# EAGLE design trainer (EAGLE 7.4.0)
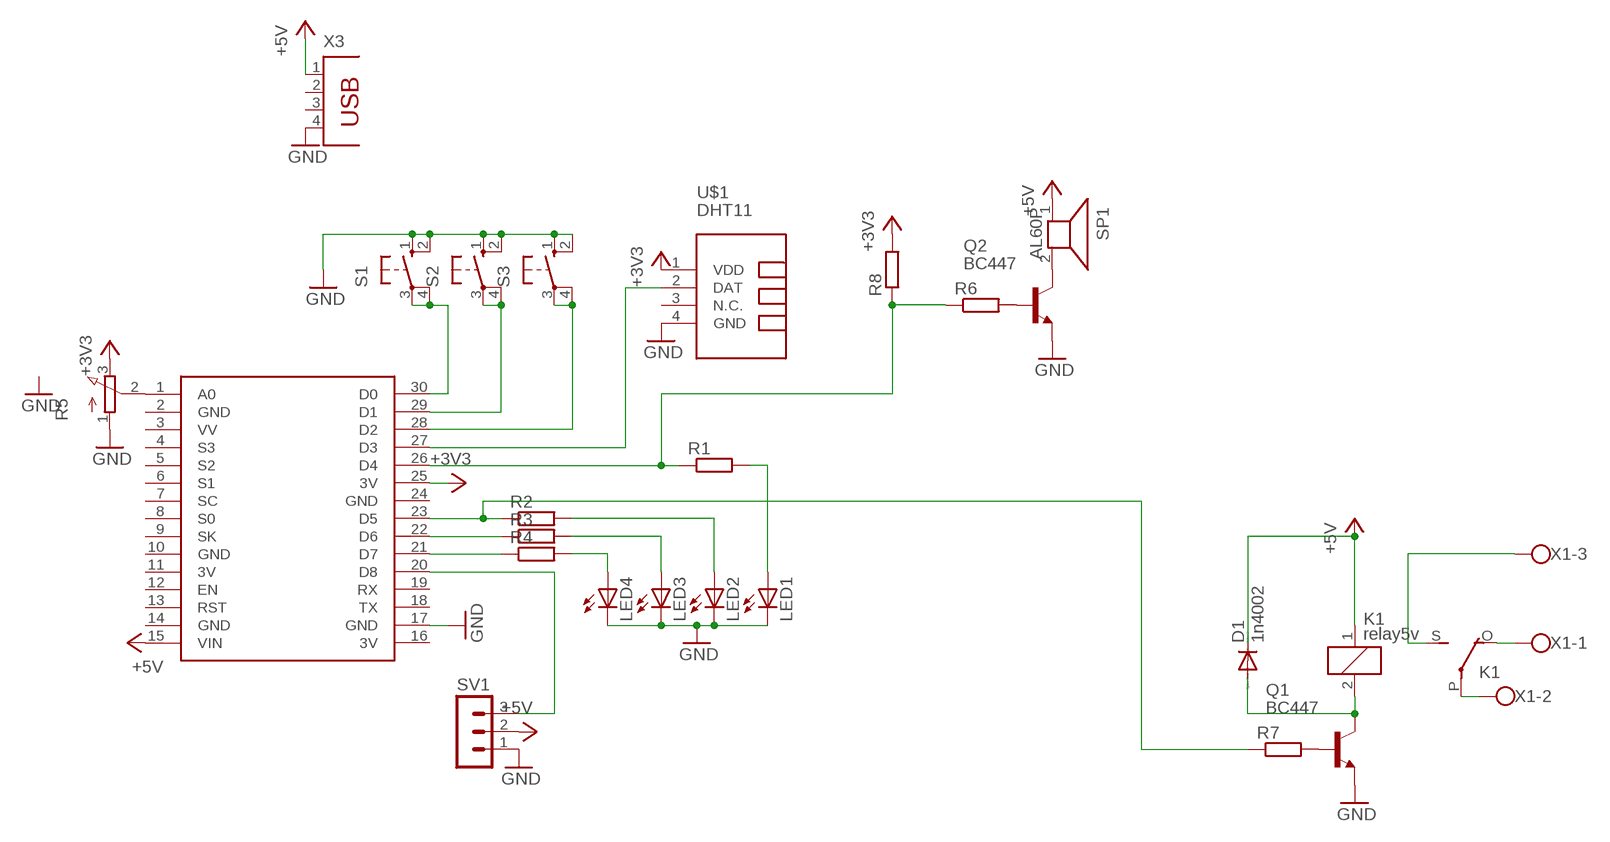
[diagram p0: schematic, sheet 1]

## Parts
D1  1n4002  1N4446  [DO35-10]
K1  relay5v  ZF112  [ZF112]
LED1  LED5MM  [LED5MM]
LED2  LED5MM  [LED5MM]
LED3  LED5MM  [LED5MM]
LED4  LED5MM  [LED5MM]
Q1  BC447  [TO92-EBC]
Q2  BC447  [TO92-EBC]
R1  R-EU_0207/10  [0207/10]
R2  R-EU_0207/10  [0207/10]
R3  R-EU_0207/10  [0207/10]
R4  R-EU_0207/10  [0207/10]
R5  3RP/1610N  [3RP/1610N]
R6  R-EU_0207/10  [0207/10]
R7  R-EU_0207/10  [0207/10]
R8  R-EU_0207/10  [0207/10]
S1  10-XX  [B3F-10XX]
S2  10-XX  [B3F-10XX]
S3  10-XX  [B3F-10XX]
SP1  AL60P  [AL60P]
SV1  MA03-1  [MA03-1]
U$1  DHT11  TEMP-HUM-SENSOR-DHT11  [TEMP-HUM-SENSOR-DHT11]
U$2  NODEMCU  [NODEMCU]
X1  W237-103  [W237-103]
X3  PN61729  [PN61729]

## Nets
+3V3: R5.3(E) R8.2 U$1.1(VDD) U$2.25(3V)
+5V: D1.C K1.1 SP1.1 SV1.2 U$2.15(VIN) X3.1
GND: LED1.K(C) LED2.K(C) LED3.K(C) LED4.K(C) Q1.E Q2.E R5.1(A) S1.1(S) S1.2(S1) S2.1(S) S2.2(S1) S3.1(S) S3.2(S1) SV1.1 U$1.4(GND) U$2.17(GND) X3.4
N$1: R1.1 R6.1 R8.1 U$2.26(D4)
N$2: R2.1 R7.1 U$2.23(D5)
N$3: R3.1 U$2.22(D6)
N$4: R4.1 U$2.21(D7)
N$5: LED1.A R1.2
N$6: LED2.A R2.2
N$7: LED3.A R3.2
N$8: LED4.A R4.2
N$9: SV1.3 U$2.20(D8)
N$10: R5.2(S) U$2.1(A0)
N$11: Q2.C SP1.2
N$12: Q2.B R6.2
N$13: K1.S(2:S) X1.3
N$14: D1.A K1.2 Q1.C
N$15: Q1.B R7.2
N$16: U$1.2(DAT) U$2.27(D3)
N$17: S1.3(P) S1.4(P1) U$2.30(D0)
N$18: S2.3(P) S2.4(P1) U$2.29(D1)
N$19: S3.3(P) S3.4(P1) U$2.28(D2)
N$20: K1.P(2:P) X1.2
N$21: K1.O(2:O) X1.1
Unconnected: U$1.3(N.C.) U$2.3(VV) U$2.4(S3) U$2.5(S2) U$2.6(S1) U$2.7(SC) U$2.8(S0) U$2.9(SK) U$2.12(EN) U$2.13(RST) U$2.18(TX) U$2.19(RX) X3.2 X3.3

## Power pins joined to a net without a drawn wire
3V: U$2.11(3V) U$2.16(3V)
GND: U$2.2(GND) U$2.10(GND) U$2.14(GND) U$2.24(GND)

## Library data of the parts
D1 = diode:1N4446: DIODE high speed (Philips)
K1 = relay:ZF112: RELAY 1 x switch; OC_FARNELL: unknown; OC_NEWARK: unknown
LED1-LED4 = led:LED: LED OSRAM: - CHIPLED LG R971, LG N971, LY N971, LG Q971, LY Q971, LO R971, LY R971 LH N974, LH R974 LS Q976, LO Q976, LY Q976 LO Q996 - Hyper CHIPLED LW Q18S LB Q993, LB Q99A, LB R99A - SideLED LS A670, LO A670, LY A670, LG A670, LP A670 LB A673, LV A673, LT A673, LW A673 LH A674 LY A675 LS A676, LA A676, LO A676, LY A676, LW A676 LS A679, LY A679, LG A679 - Hyper Micro SIDELED® LS Y876, LA Y876, LO Y876, LY Y876 LT Y87S - SmartLED LW L88C, LW L88S LB L89C, LB L89S, LG L890 LS L89K, LO L89K, LY L89K LS L896, LA L896, LO L896, LY L896 - TOPLED LS T670, LO T670, LY T670, LG T670, LP T670 LSG T670, LSP T670, LSY T670, LOP T670, LYG T670 LG T671, LOG T671, LSG T671 LB T673, LV T673, LT T673, LW T673 LH T674 LS T676, LA T676, LO T676, LY T676, LB T676, LH T676, LSB T676, LW T676 LB T67C, LV T67C, LT T67C, LS T67K, LO T67K, LY T67K, LW E67C LS E67B, LA E67B, LO E67B, LY E67B, LB E67C, LV E67C, LT E67C LW T67C LS T679, LY T679, LG T679 LS T770, LO T770, LY T770, LG T770, LP T770 LB T773, LV T773, LT T773, LW T773 LH T774 LS E675, LA E675, LY E675, LS T675 LS T776, LA T776, LO T776, LY T776, LB T776 LHGB T686 LT T68C, LB T68C - Hyper Mini TOPLED® LB M676 - Mini TOPLED Santana® LG M470 LS M47K, LO M47K, LY M47K Source: http://www.osram.convergy.de LUXEON: - LUMILED® LXK2-PW12-R00, LXK2-PW12-S00, LXK2-PW14-U00, LXK2-PW14-V00 LXK2-PM12-R00, LXK2-PM12-S00, LXK2-PM14-U00 LXK2-PE12-Q00, LXK2-PE12-R00, LXK2-PE12-S00, LXK2-PE14-T00, LXK2-PE14-U00 LXK2-PB12-K00, LXK2-PB12-L00, LXK2-PB12-M00, LXK2-PB14-N00, LXK2-PB14-P00, LXK2-PB14-Q00 LXK2-PR12-L00, LXK2-PR12-M00, LXK2-PR14-Q00, LXK2-PR14-R00 LXK2-PD12-Q00, LXK2-PD12-R00, LXK2-PD12-S00 LXK2-PH12-R00, LXK2-PH12-S00 LXK2-PL12-P00, LXK2-PL12-Q00, LXK2-PL12-R00 Source: www.luxeon.com KINGBRIGHT: KA-3528ASYC Source: www.kingbright.com
Q1 Q2 = transistor-npn:BC447*: NPN Transistor
R1-R4 R6-R8 = rcl:R-EU_: RESISTOR, European symbol
R5 = pot:3RP/1610N: 16mm Potentiometer one level Source: http://www.alphapotentiometers.net/html/16mm_pot_2.html
S1-S3 = switch-omron:10-XX: OMRON SWITCH; MPN: B3F-1000; OC_FARNELL: 176432; OC_NEWARK: 36M3542
SP1 = buzzer:AL60P: SPEAKER Source: Buerklin; OC_FARNELL: unknown; OC_NEWARK: unknown
SV1 = con-lstb:MA03-1: PIN HEADER; OC_FARNELL: unknown; OC_NEWARK: unknown
U$1 = diy-modules:TEMP-HUM-SENSOR-DHT11: DHT11 - digital humidity & temperature sensor DHT11 datasheet available here: https://akizukidenshi.com/download/ds/aosong/DHT11.pdf Click here to find device on ebay.com <http://www.ebay.com/sch/dht11+digital+sensor>
U$2 = nodemcu:NODEMCU
X1 = con-wago-500:W237-103: WAGO SCREW CLAMP; MPN: 237-103; OC_FARNELL: unknown; OC_NEWARK: 18M7116
X3 = con-berg:PN61729: BERG USB connector; OC_FARNELL: unknown; OC_NEWARK: unknown

## Board
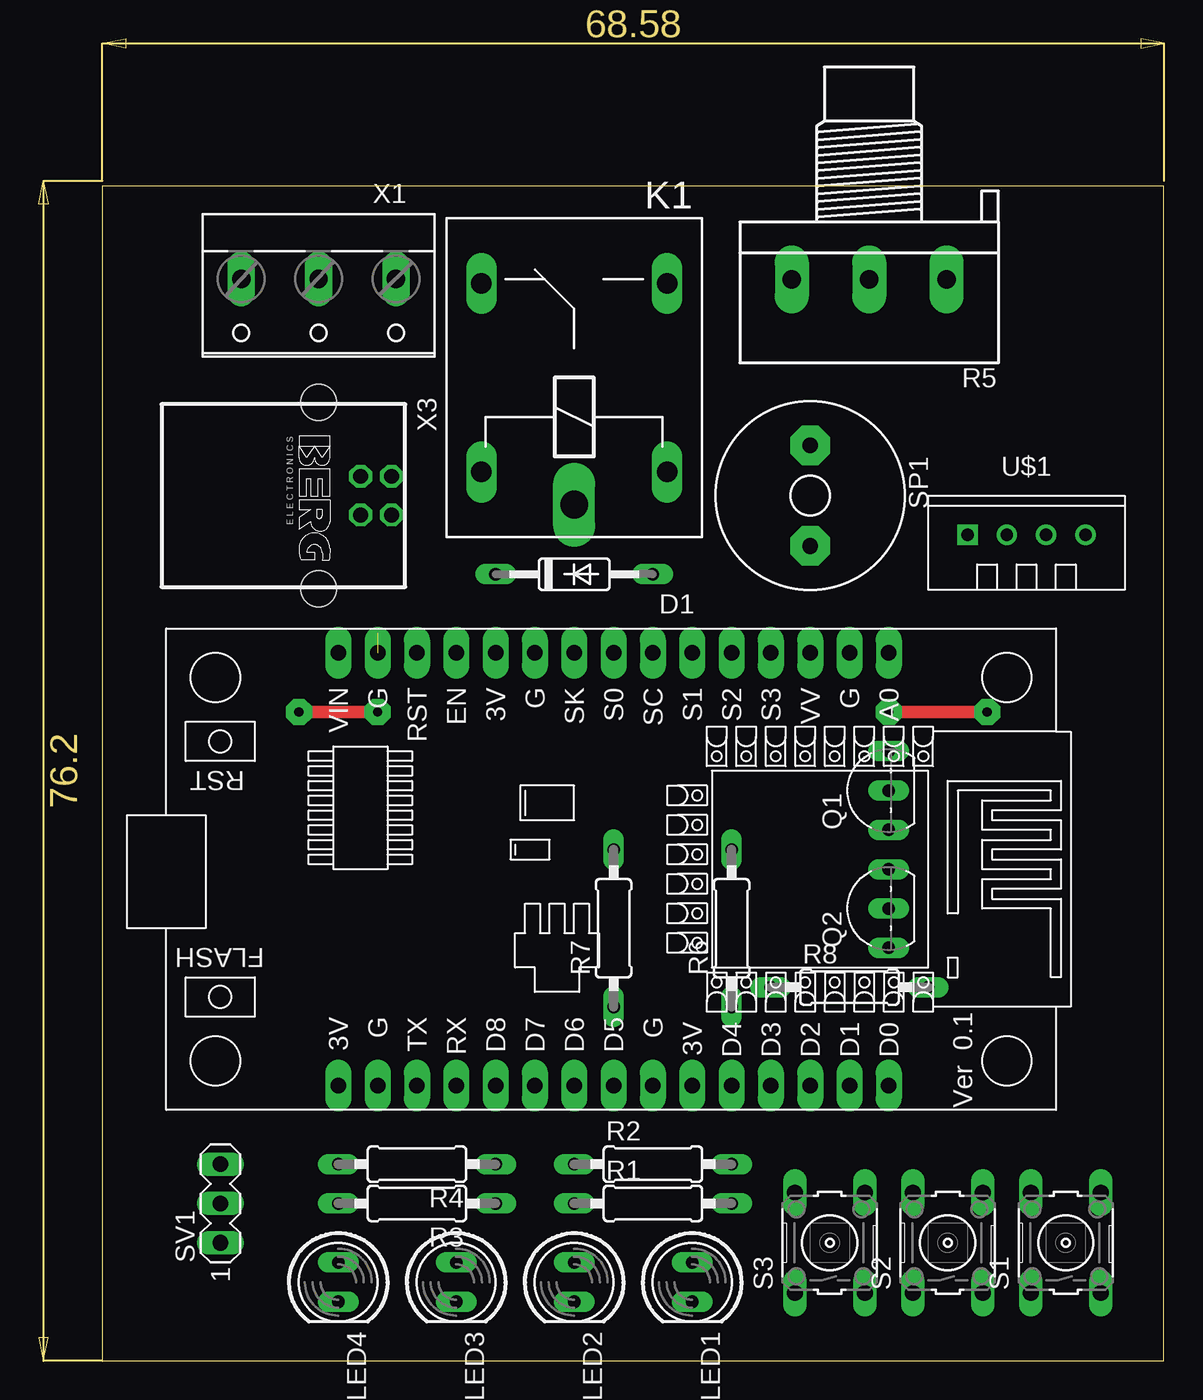
[diagram p1: board, top side]
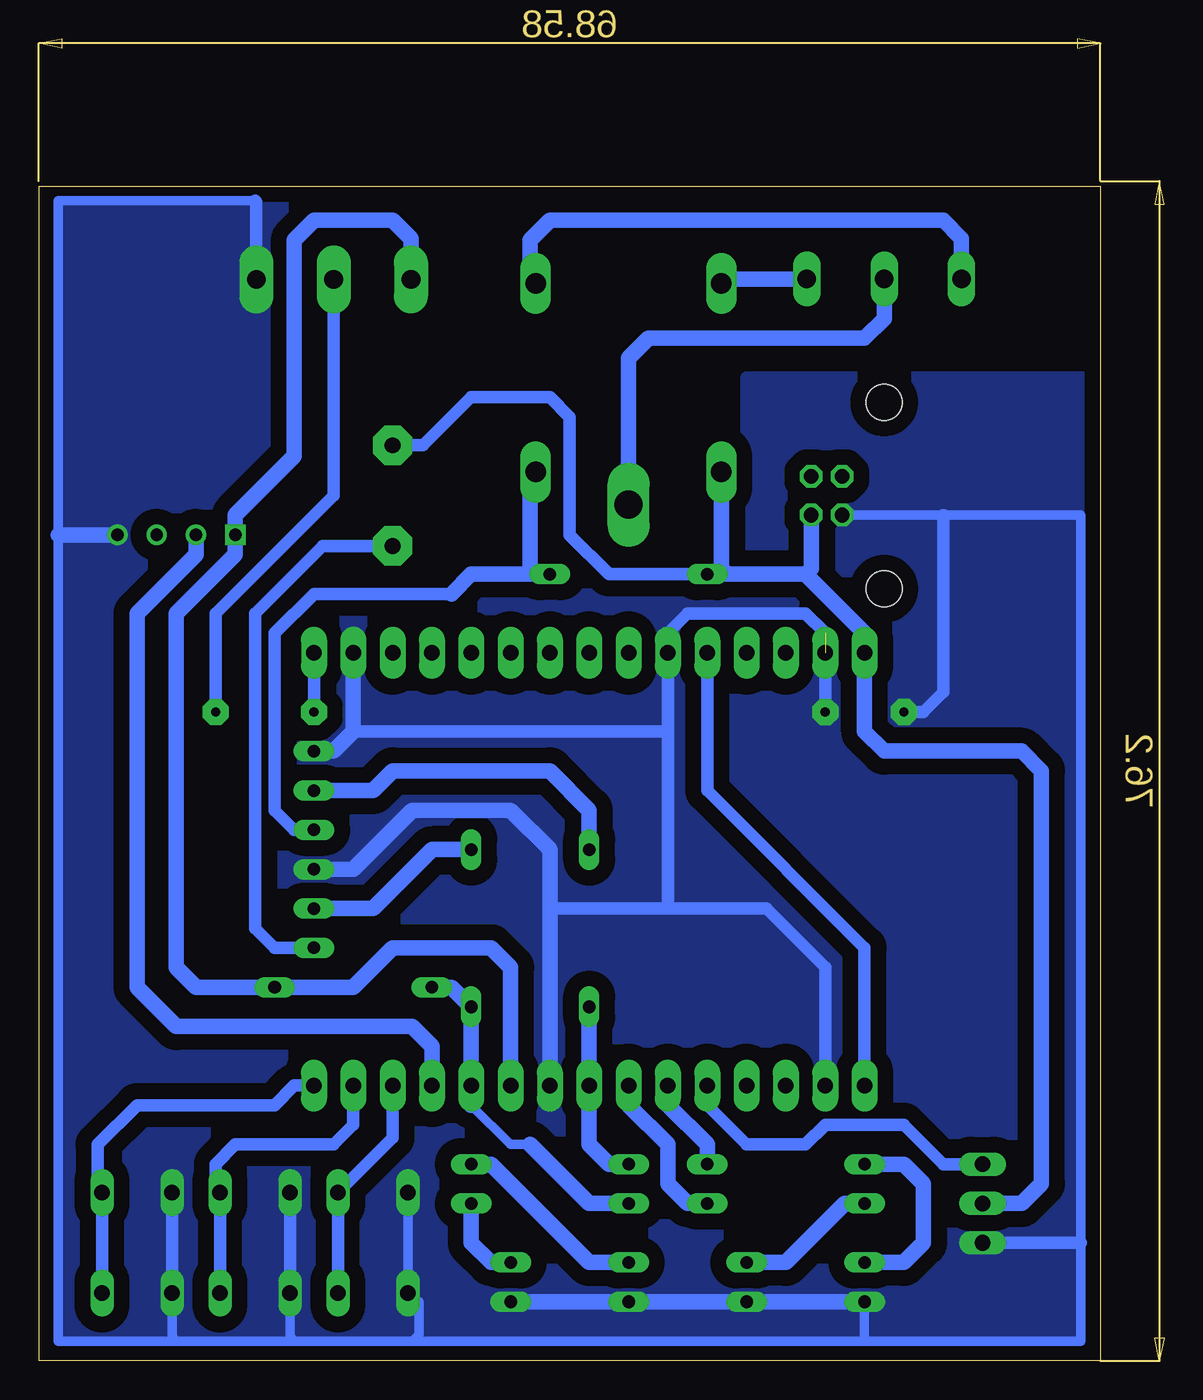
[diagram p2: board, bottom side, seen from below]

Size 68.56 x 75.87 mm. Coordinates in mm from the lower left corner, seen from the top.
Outline: 0,0 68.56,0 68.56,75.87 0,75.87 0,0
Copper layers (1*16): Top 0.035mm / dielectric 1.5mm / Bottom 0.035mm
Design rules "default": minimum track width 10mil, minimum drill 24mil, track to track 8mil, track to pad 8mil, pad to pad 8mil, via to via 8mil, smd to smd 8mil, copper to edge 40mil, drill to drill 8mil, minimum pad ring 10mil, minimum via ring 8mil, stop-mask expansion 4mil, vias tented up to drill 0mil, thermal gap 10mil

### Footprints (pad centres in the part's own frame; a part is rotated, then mirrored left to right if it is on the bottom)
DO35-10 = drill 0.813 long: A 5.08,0; C -5.08,0
ZF112 = drill 1.321 long: 1 -6.096,5.994; 2 -6.096,-5.994; O 6.096,5.994; S 6.096,-5.994 | drill 1.803 long: P -8.204,0
LED5MM = drill 0.813 long: A -1.27,0; K 1.27,0
TO92-EBC = drill 0.813 long: B 0,-1.27; C -2.54,-1.27; E 2.54,-1.27
0207/10 = drill 0.813 long: 1 -5.08,0; 2 5.08,0
3RP/1610N = drill 1.2 pad 2.184 long: 1 -5,0; 2 0,0; 3 5,0
B3F-10XX = drill 1.016 long: 1 -3.251,2.261; 2 3.251,2.261; 3 -3.251,-2.261; 4 3.251,-2.261
AL60P = drill 1.016 pad 2.54 octagon: 1 -3.251,0; 2 3.251,0
MA03-1 = drill 1.016 long: 1 -2.54,0; 2 0,0; 3 2.54,0
TEMP-HUM-SENSOR-DHT11 = drill 0.8 square: 1 -3.81,0 | drill 0.8: 2 -1.27,0; 3 1.27,0; 4 3.81,0
NODEMCU = drill 1 pad 1.676 long: 1 -13.97,17.78; 2 -13.97,15.24; 3 -13.97,12.7; 4 -13.97,10.16; 5 -13.97,7.62; 6 -13.97,5.08; 7 -13.97,2.54; 8 -13.97,0; 9 -13.97,-2.54; 10 -13.97,-5.08; 11 -13.97,-7.62; 12 -13.97,-10.16; 13 -13.97,-12.7; 14 -13.97,-15.24; 15 -13.97,-17.78; 16 13.97,-17.78; 17 13.97,-15.24; 18 13.97,-12.7; 19 13.97,-10.16; 20 13.97,-7.62; 21 13.97,-5.08; 22 13.97,-2.54; 23 13.97,0; 24 13.97,2.54; 25 13.97,5.08; 26 13.97,7.62; 27 13.97,10.16; 28 13.97,12.7; 29 13.97,15.24; 30 13.97,17.78
W237-103 = drill 1.194 long: 1 -5,-1.29; 2 0,-1.29; 3 5,-1.29
PN61729 = drill 0.95 octagon: 1 1.25,4.71; 2 -1.25,4.71; 3 -1.25,2.71; 4 1.25,2.71 | hole 2.3: -6.02,0; 6.02,0

### Placement (x,y rotation side)
D1  30.48,50.8 0 top
K1  30.48,63.5 90 top
LED1  38.1,5.08 270 top
LED2  30.48,5.08 270 top
LED3  22.86,5.08 270 top
LED4  15.24,5.08 270 top
Q1  49.53,36.83 90 top
Q2  49.53,29.21 90 top
R1  35.56,10.16 0 top
R2  35.56,12.7 0 top
R3  20.32,10.16 180 top
R4  20.32,12.7 180 top
R5  49.53,69.85 180 top
R6  40.64,27.94 90 top
R7  33.02,27.94 90 top
R8  48.26,24.13 0 top
S1  62.23,7.62 90 top
S2  54.61,7.62 90 top
S3  46.99,7.62 90 top
SP1  45.72,55.88 270 top
SV1  7.62,10.16 90 top
U$1  59.69,53.34 0 top
U$2  33.02,31.75 270 top
X1  13.97,68.58 180 top
X3  13.97,55.88 270 top

### Tracks (layer width: path | path; a pad name or v marks a point on that pad's centre or on a via)
3V
  Bottom 0.813: U$2.16 15.24,26.67 25.4,36.83 U$2.11
+3V3
  Bottom 1.016: R5.3 44.53,72.47 45.72,73.66 50.8,73.66 52.07,72.39 52.07,58.42 55.88,54.61 U$1.1 55.88,52.07 59.69,48.26 59.69,25.4 58.42,24.13 R8.2 48.26,24.13 45.72,26.67 39.37,26.67 38.1,25.4 U$2.25
+5V
  Bottom 0.813: SP1.1 43.74,59.13 40.64,62.23 35.56,62.23 34.29,60.96 34.29,53.34 31.75,50.8 D1.C
  Bottom 1.016: 24.13,57.76 K1.1 24.49,51.16 24.13,50.8 | 19.05,50.8 15.24,46.99 U$2.15 15.24,40.64 13.97,39.37 5.08,39.37 3.81,38.1 3.81,11.43 5.08,10.16 SV1.2 | 19.05,50.8 24.13,50.8 | 24.13,50.8 D1.C | X3.1 18.68,51.17 19.05,50.8
GND  (via drill 0.6 pad 1.68)  (1 unrouted)
  Top 0.813: v17.78,41.91 v12.7,41.91
  Bottom 0.61: X3.4 10.16,54.63 1.27,54.63 1.27,7.62 1.27,1.27 15.24,1.27 | 15.24,1.27 44.45,1.27 | 44.45,1.27 52.07,1.27 | 52.07,1.27 59.69,1.27 | 59.69,1.27 67.31,1.27 67.31,53.34 67.31,74.93 54.61,74.93 | LED4.K 15.24,1.27 | S3.2 S3.1 44.02,3.81 44.02,1.7 44.45,1.27 | S2.1 52.35,1.55 52.07,1.27 | S1.1 59.97,1.55 59.69,1.27
  Bottom 0.813: S1.2 S1.1 | S2.2 S2.1 | R5.1 54.53,74.85 54.61,74.93 | SV1.1 1.27,7.62 | 27.94,40.64 U$2.10 27.94,46.99 26.67,48.26 19.05,48.26 17.78,46.99 | U$2.17 17.78,25.4 21.59,29.21 27.94,29.21 | 48.26,40.64 27.94,40.64 | 27.94,40.64 27.94,29.21 | 27.94,29.21 35.56,29.21 | U$2.14 v17.78,41.91 | v12.7,41.91 11.43,41.91 10.16,43.18 10.16,54.63
  Bottom 1.016: LED1.K LED2.K LED3.K LED4.K | U$2.2 48.26,40.64 49.53,39.37 Q1.E | Q2.E 48.26,31.75 44.45,35.56 38.1,35.56 35.56,33.02 35.56,29.21 U$2.24 | U$1.4 67.31,53.34
  pour Bottom (isolate 1.016, no thermals): 0,0 0,63.5 22.86,63.5 22.86,53.34 29.21,53.34 29.21,76.2 68.58,76.2 68.58,0
N$1
  Bottom 0.61: 36.83,13.97 38.1,13.97 40.64,16.51
  Bottom 1.016: R1.1 33.02,10.16 36.83,13.97 | 40.64,16.51 U$2.26 R6.1 41.91,24.13 R8.1
N$2
  Bottom 1.016: R2.1 31.75,12.7 33.02,13.97 U$2.23 R7.1
N$3
  Bottom 1.016: U$2.22 30.48,16.51 27.94,13.97 27.94,11.43 26.67,10.16 R3.1
N$4
  Bottom 1.016: U$2.21 27.94,16.51 25.4,13.97 R4.1
N$5
  Bottom 1.016: R1.2 40.64,7.62 39.37,6.35 LED1.A
N$6
  Bottom 1.016: R2.2 39.37,12.7 33.02,6.35 LED2.A
N$7
  Bottom 1.016: R3.2 16.51,10.16 20.32,6.35 LED3.A
N$8
  Bottom 1.016: R4.2 12.7,12.7 11.43,11.43 11.43,7.62 12.7,6.35 LED4.A
N$9
  Bottom 0.813: U$2.20 25.4,16.51 22.86,13.97 19.05,13.97 17.78,15.24 12.7,15.24 10.16,12.7 SV1.3
N$10  (via drill 0.6 pad 1.68)
  Top 0.813: v50.8,41.91 v57.15,41.91
  Bottom 0.813: U$2.1 v50.8,41.91 | v57.15,41.91 57.15,48.26 49.53,55.88 R5.2
N$11
  Bottom 0.813: SP1.2 50.24,52.63 54.61,48.26 54.61,27.94 53.34,26.67 Q2.C
N$12
  Bottom 1.016: R6.2 43.18,33.02 46.99,29.21 Q2.B
N$13
  Bottom 1.016: X1.3 8.97,72.47 10.16,73.66 35.56,73.66 36.83,72.39 36.83,69.95 K1.S
N$14
  Bottom 0.813: 41.91,49.53 50.8,49.53 53.34,46.99 53.34,35.56 52.07,34.29 Q1.C
  Bottom 1.016: D1.A 36.83,50.8 | 36.83,50.8 40.64,50.8 41.91,49.53 | K1.2 36.83,57.4 36.83,50.8
N$15
  Bottom 1.016: Q1.B 46.99,36.83 45.72,38.1 35.56,38.1 33.02,35.56 R7.2
N$16
  Bottom 1.016: U$2.27 43.18,20.32 44.45,21.59 59.69,21.59 62.23,24.13 62.23,48.26 58.42,52.07 U$1.2
N$17
  Bottom 0.813: U$2.30 52.07,17.78 53.34,16.51 62.23,16.51 64.77,13.97 64.77,11.15 S1.4 S1.3
N$18
  Bottom 0.813: U$2.29 48.26,15.24 49.53,13.97 55.88,13.97 57.15,12.7 57.15,9.88 S2.4 S2.3
N$19
  Bottom 0.813: U$2.28 45.72,14.4 S3.4 S3.3
N$20
  Bottom 1.016: X1.2 13.97,67.31 15.24,66.04 29.21,66.04 30.48,64.77 K1.P
N$21
  Bottom 1.016: X1.1 24.21,69.87 K1.O